# Altium schematic sheet ADC_Reference.SchDoc: ADC Reference
size A4; Organization: Altium Limited; Address1: L3, 12a Rodborough Rd; Address2: Frenchs Forest; Address3: NSW; Address4: Australia 2086
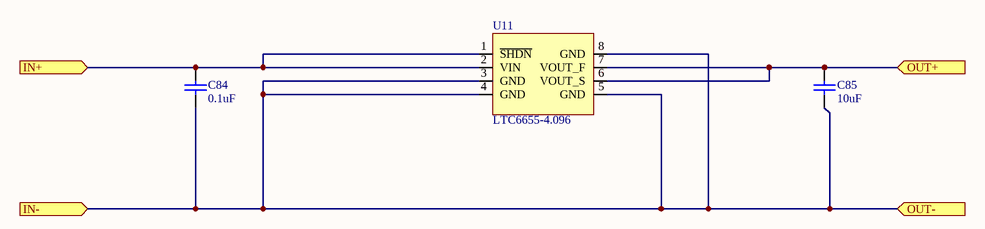
[diagram p0: ADC_Reference.SchDoc]

## Parts
C84  0.1uF  [0402_Cap]
C85  10uF  [0402_Cap]
U11  LTC6655-4.096  [MSOP_8]

## Ports
IN+ (in), IN- (in), OUT+ (in), OUT- (in)

## Nets
IN+: C84.2 U11.1(~{SHDN}) U11.2(VIN) ; port IN+
IN-: C84.1 C85.1 U11.3(GND) U11.4(GND) U11.5(GND) U11.8(GND) ; port OUT-, port IN-
OUT+: C85.2 U11.6(VOUT_S) U11.7(VOUT_F) ; port OUT+

## Notes on the sheet
- Title
- Date:
- RE:
- Arturo di Girolamo
- Size:
- A3
- A

## Library data of the parts
C84 = CL21B104KACNNNC: Capacitor, 0.1uF, 0805; Value: .01uf; ASYPN: 0402YC104KAT2A; MFGPN: CL21B104KACNNNC
C85 = CL21A106KAFN3NE: Capacitor, 10uF, 0805; Value: .01uf; ASYPN: CL05A106MQ5NUNC; MFGPN: CL21A106KAFN3NE
U11 = LTC6655CHMS8-4.096#PBF: Voltage Reference 4.096V; MFGPN: LTC6655CHMS8-4.096#PBF; ASYPN: LTC6655CHMS8-4.096#PBF